# Altium schematic sheet 03 Peripherals.SchDoc
size A
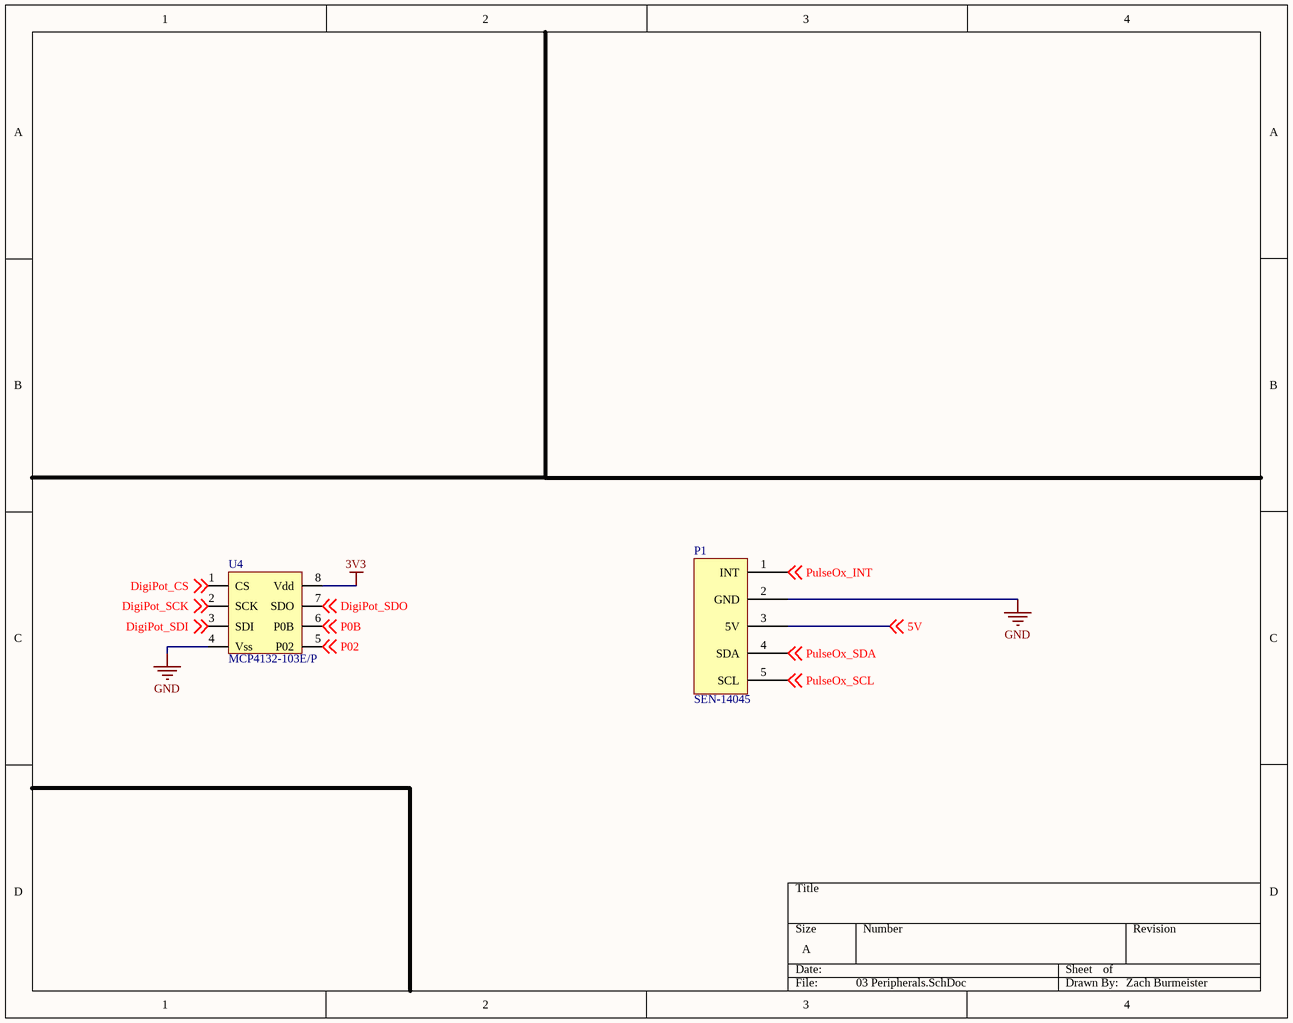
[diagram p0: 03 Peripherals.SchDoc]

## Parts
P1  SEN-14045  [5 pin header]
U4  MCP4132-103E/P  [DIP8]

## Nets
3V3: U4.8(Vdd)
GND: P1.2(GND) U4.4(Vss)
5V: P1.3(5V) ; off-sheet 5V
DigiPot_CS: U4.1(CS) ; off-sheet DigiPot_CS
DigiPot_SCK: U4.2(SCK) ; off-sheet DigiPot_SCK
DigiPot_SDI: U4.3(SDI) ; off-sheet DigiPot_SDI
DigiPot_SDO: U4.7(SDO) ; off-sheet DigiPot_SDO
P0B: U4.6(P0B) ; off-sheet P0B
P02: U4.5(P02) ; off-sheet P02
PulseOx_INT: P1.1(INT) ; off-sheet PulseOx_INT
PulseOx_SCL: P1.5(SCL) ; off-sheet PulseOx_SCL
PulseOx_SDA: P1.4(SDA) ; off-sheet PulseOx_SDA

## Notes on the sheet
- Zach Burmeister

## Library data of the parts
P1 = SEN-14045: Pulse Ox
U4 = MCP4132-103E/P: Digital Pot